# EasyEDA schematic SCH_USB Timer_2022-08-03.json
TITLE: Sheet_1; REV: 0.2; Date: 2022-07-23; Sheet: 1/1; Drawn By: Spencer Owen; Company: Your Company
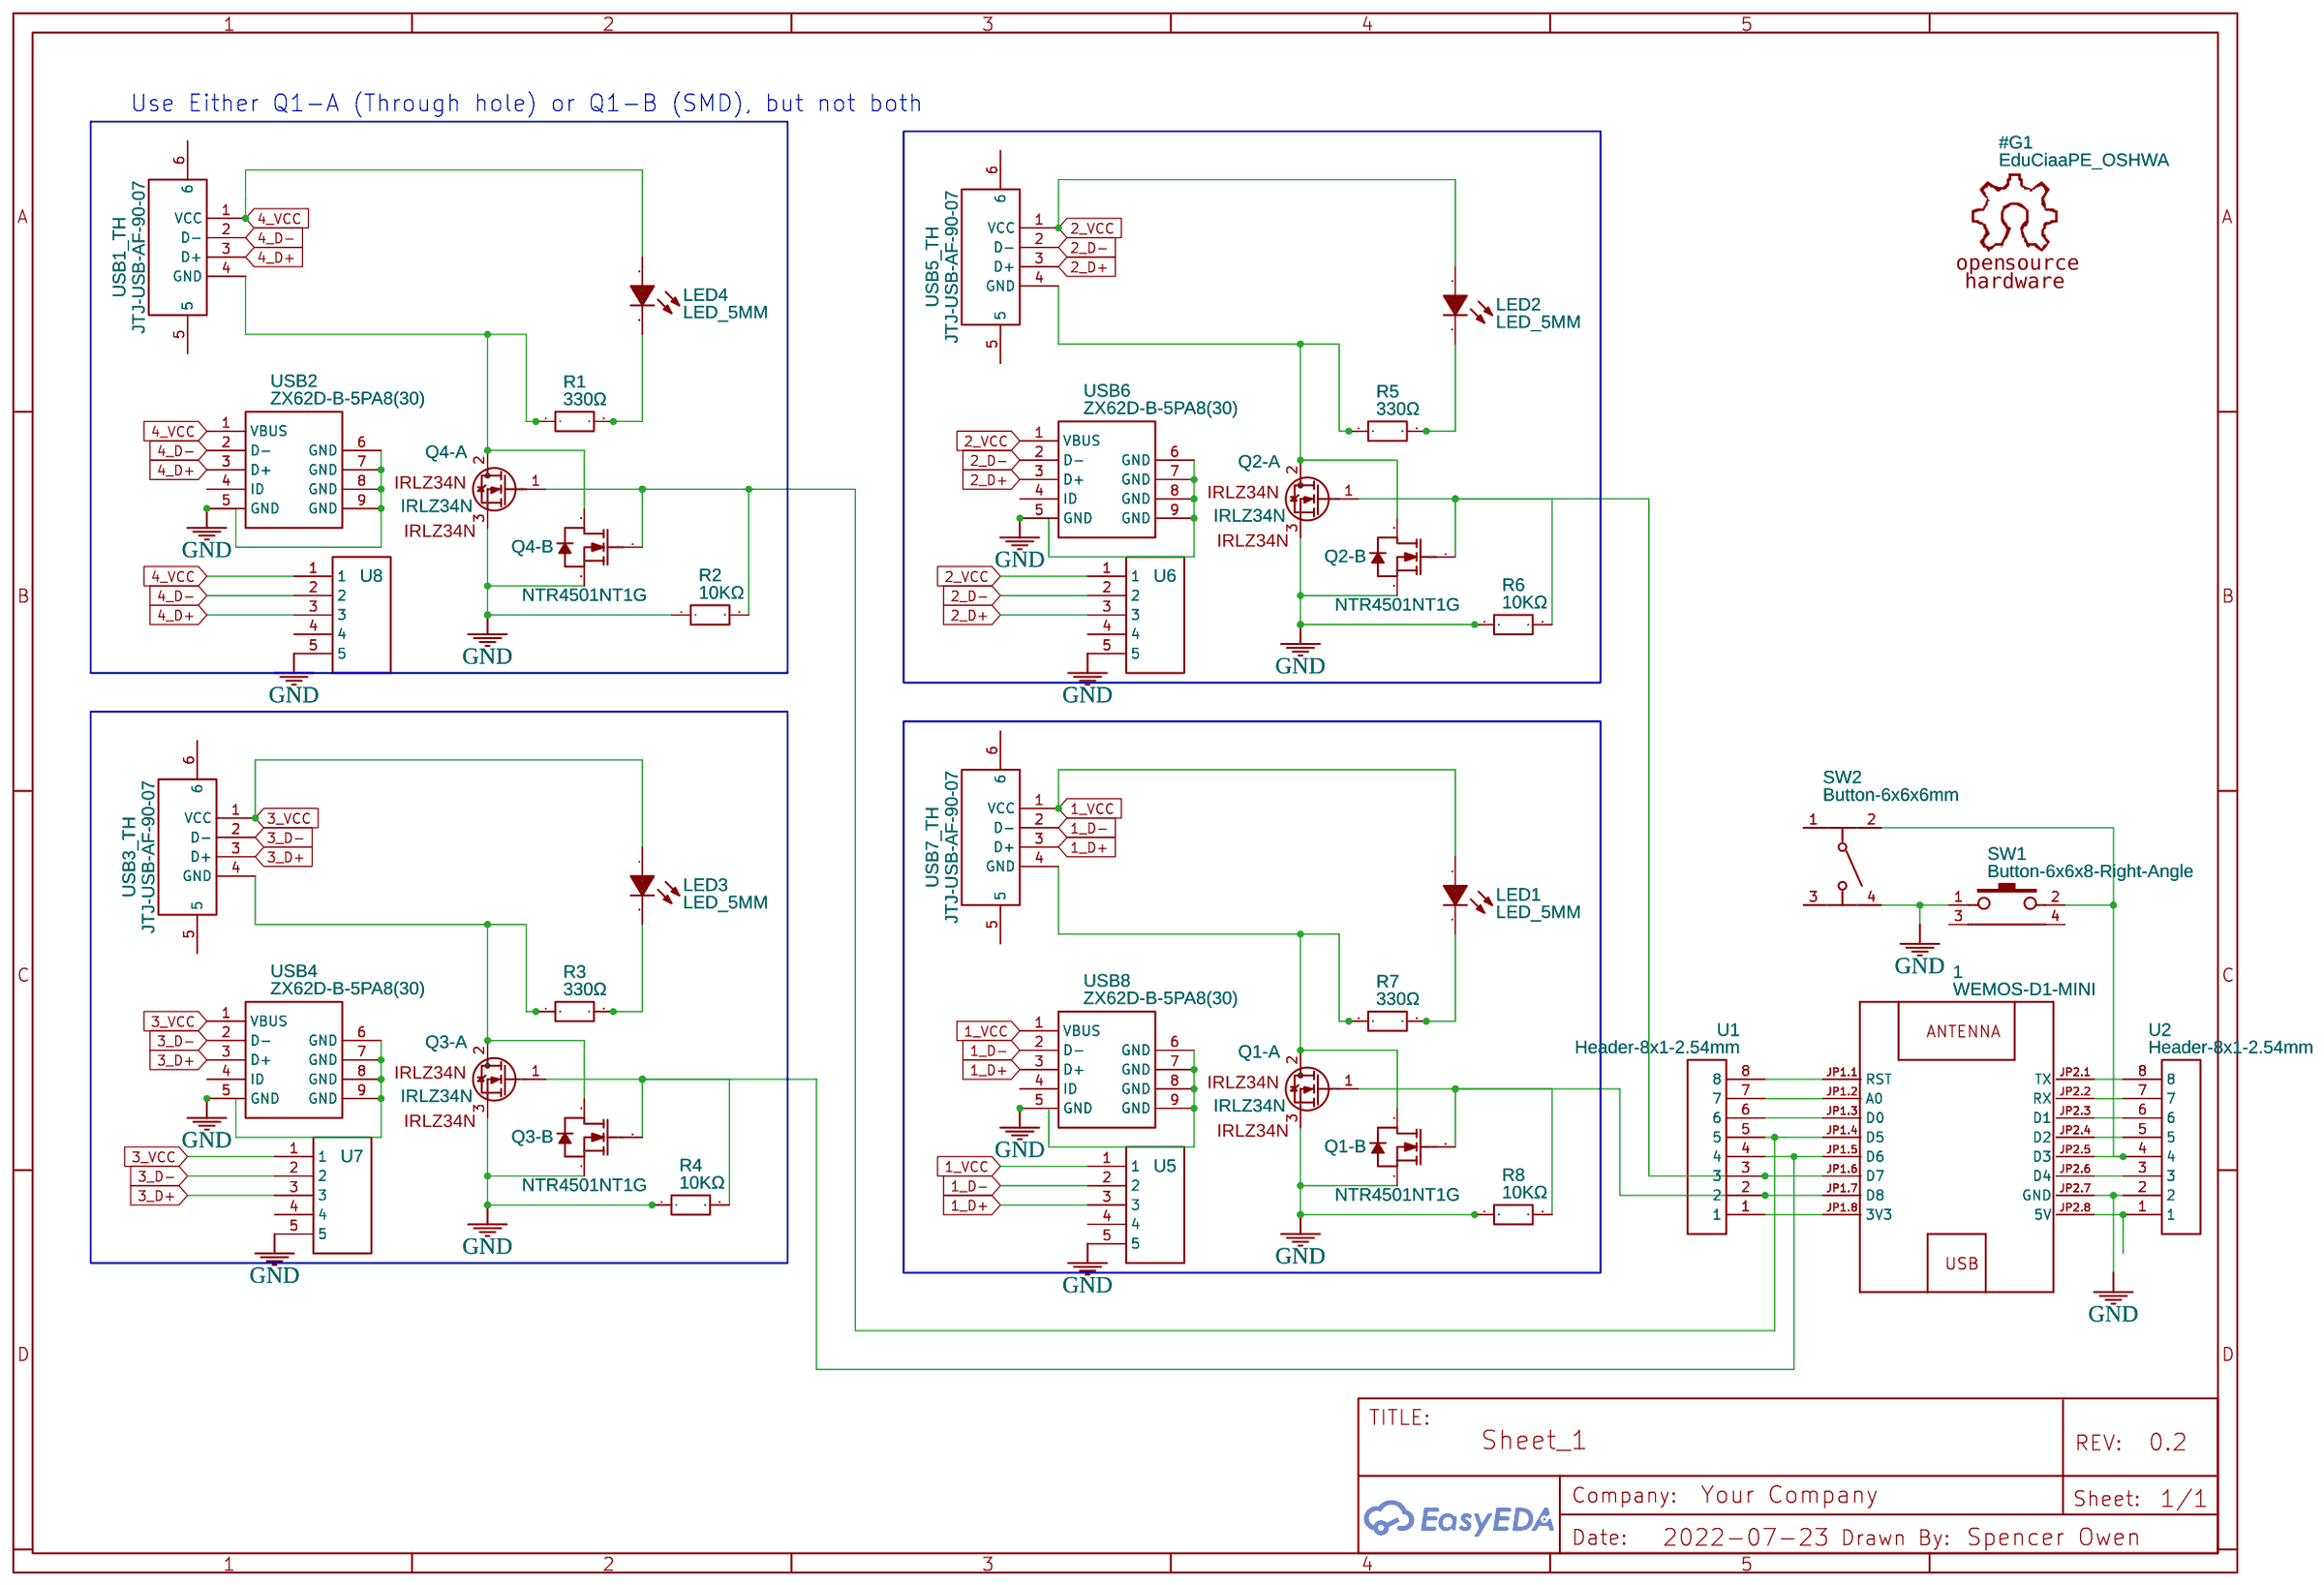
[diagram p0: schematic sheet]

## Parts
1  WEMOS-D1-MINI  [WEMOS-D1-MINI]
#G1  EduCiaaPE_OSHWA  [LOGO_OSHWA]
LED1  LED_5MM  [LED-TH_BD5.0-P2.54-FD_C9900023552]
LED2  LED_5MM  [LED-TH_BD5.0-P2.54-FD_C9900023552]
LED3  LED_5MM  [LED-TH_BD5.0-P2.54-FD_C9900023552]
LED4  LED_5MM  [LED-TH_BD5.0-P2.54-FD_C9900023552]
Q1-A  IRLZ34N  [IRLZ34N]
Q1-B  NTR4501NT1G  [SOT-23-3_L2.9-W1.3-P1.90-LS2.4-BR]
Q2-A  IRLZ34N  [IRLZ34N]
Q2-B  NTR4501NT1G  [SOT-23-3_L2.9-W1.3-P1.90-LS2.4-BR]
Q3-A  IRLZ34N  [IRLZ34N]
Q3-B  NTR4501NT1G  [SOT-23-3_L2.9-W1.3-P1.90-LS2.4-BR]
Q4-A  IRLZ34N  [IRLZ34N]
Q4-B  NTR4501NT1G  [SOT-23-3_L2.9-W1.3-P1.90-LS2.4-BR]
R1  330Ω  [RES-TH_BD2.4-L6.3-P10.30-D0.6]
R2  10KΩ  [RES-TH_BD2.4-L6.3-P10.30-D0.6]
R3  330Ω  [RES-TH_BD2.4-L6.3-P10.30-D0.6]
R4  10KΩ  [RES-TH_BD2.4-L6.3-P10.30-D0.6]
R5  330Ω  [RES-TH_BD2.4-L6.3-P10.30-D0.6]
R6  10KΩ  [RES-TH_BD2.4-L6.3-P10.30-D0.6]
R7  330Ω  [RES-TH_BD2.4-L6.3-P10.30-D0.6]
R8  10KΩ  [RES-TH_BD2.4-L6.3-P10.30-D0.6]
SW1  Button-6x6x8-Right-Angle  [SW-TH_BBJ-C71833]
SW2  Button-6x6x6mm  [SW-TH_4P-L6.0-W6.0-P4.50-LS6.1]
U1  Header-8x1-2.54mm  [HEADER-8X1-2.54MM]
U2  Header-8x1-2.54mm  [HEADER-8X1-2.54MM]
U5  Header-5x1-2.54mm  [HEADER-5X1-2.54MM]
U6  Header-5x1-2.54mm  [HEADER-5X1-2.54MM]
U7  Header-5x1-2.54mm  [HEADER-5X1-2.54MM]
U8  Header-5x1-2.54mm  [HEADER-5X1-2.54MM]
USB1_TH  JTJ-USB-AF-90-07  [USB-A-TH_C42650]
USB2  ZX62D-B-5PA8(30)  [MICRO-USB-SMD_ZX62D-B-5PA8-30]
USB3_TH  JTJ-USB-AF-90-07  [USB-A-TH_C42650]
USB4  ZX62D-B-5PA8(30)  [MICRO-USB-SMD_ZX62D-B-5PA8-30]
USB5_TH  JTJ-USB-AF-90-07  [USB-A-TH_C42650]
USB6  ZX62D-B-5PA8(30)  [MICRO-USB-SMD_ZX62D-B-5PA8-30]
USB7_TH  JTJ-USB-AF-90-07  [USB-A-TH_C42650]
USB8  ZX62D-B-5PA8(30)  [MICRO-USB-SMD_ZX62D-B-5PA8-30]

## Library data of the parts
1 = WEMOS-D1-MINI: Contributor: 4ndy
#G1 = EduCiaaPE_OSHWA: Contributor: Juan Pablo Menditto
LED1-LED4 = LED_5MM: Supplier: LCSC; Supplier Part: C9900023552; Manufacturer: null; JLCPCB Part Class: Extended Part; Contributor: lcsc
Q1-A Q2-A Q3-A Q4-A = IRLZ34N: Contributor: WDMason
Q1-B Q2-B Q3-B Q4-B = NTR4501NT1G: Supplier: LCSC; Manufacturer: ON; Supplier Part: C85416; JLCPCB Part Class: Extended Part
R1-R8 = MFR-25FBF52-93K1: Supplier: LCSC; Supplier Part: C1369201; Manufacturer: YAGEO(国巨); link: https://atta.szlcsc.com/upload/public/pdf/source/20210730/C1369201_7B4B073A00DCD3392AECD92F10A4BDE9.pdf; Resistance: 93.1kΩ; Contributor: lcsc
SW1 = Button-6x6x8-Right-Angle: Supplier Part: C71833; Supplier: LCSC; Manufacturer: BBJ; Manufacturer Part: 6*6*8Plastic head,260G, 0.25mm,Side bracket
SW2 = Button-6x6x6mm: Supplier Part: C71836; Supplier: LCSC; Manufacturer: BBJ; Manufacturer Part: Switch,6*6*6Plastic head,260G, 0.25mm,Straight line
U1 U2 = Header-8x1-2.54mm: Contributor: abdussamet28051999
U5-U8 = Header-5x1-2.54mm: Contributor: abdussamet28051999
USB1_TH USB3_TH USB5_TH USB7_TH = JTJ-USB-AF-90-07: Supplier: LCSC; Supplier Part: C42650; Manufacturer: LCSC; Contributor: LCSC; JLCPCB Part Class: Extended Part
USB2 USB4 USB6 USB8 = ZX62D-B-5PA8(30): Supplier: LCSC; Supplier Part: C132350; Manufacturer: HRS(Hirose); Contributor: LCSC; JLCPCB Part Class: Extended Part

## Nets
GND: 1.JP2.7(GND) Q1-A.3(S) Q1-B.2(S) Q2-A.3(S) Q2-B.2(S) Q3-A.3(S) Q3-B.2(S) Q4-A.3(S) Q4-B.2(S) R2.1 R4.1 R6.1 R8.1 SW1.1 SW2.4 U2.2 U5.5 U6.5 U7.5 U8.5 USB2.5(GND) USB2.6(GND) USB2.7(GND) USB2.8(GND) USB2.9(GND) USB4.5(GND) USB4.6(GND) USB4.7(GND) USB4.8(GND) USB4.9(GND) USB6.5(GND) USB6.6(GND) USB6.7(GND) USB6.8(GND) USB6.9(GND) USB8.5(GND) USB8.6(GND) USB8.7(GND) USB8.8(GND) USB8.9(GND)
1_D+: U5.3 USB7_TH.3(D+) USB8.3(D+)
1_D-: U5.2 USB7_TH.2(D-) USB8.2(D-)
1_VCC: LED1.1(A) U5.1 USB7_TH.1(VCC) USB8.1(VBUS)
2_D+: U6.3 USB5_TH.3(D+) USB6.3(D+)
2_D-: U6.2 USB5_TH.2(D-) USB6.2(D-)
2_VCC: LED2.1(A) U6.1 USB5_TH.1(VCC) USB6.1(VBUS)
3_D+: U7.3 USB3_TH.3(D+) USB4.3(D+)
3_D-: U7.2 USB3_TH.2(D-) USB4.2(D-)
3_VCC: LED3.1(A) U7.1 USB3_TH.1(VCC) USB4.1(VBUS)
4_D+: U8.3 USB1_TH.3(D+) USB2.3(D+)
4_D-: U8.2 USB1_TH.2(D-) USB2.2(D-)
4_VCC: LED4.1(A) U8.1 USB1_TH.1(VCC) USB2.1(VBUS)
Net-(1-JP1.1): 1.JP1.1(RST) U1.8
Net-(1-JP1.2): 1.JP1.2(A0) U1.7
Net-(1-JP1.3): 1.JP1.3(D0) U1.6
Net-(1-JP1.4): 1.JP1.4(D5) Q4-A.1(G) Q4-B.1(G) R2.2 U1.5
Net-(1-JP1.5): 1.JP1.5(D6) Q3-A.1(G) Q3-B.1(G) R4.2 U1.4
Net-(1-JP1.6): 1.JP1.6(D7) Q2-A.1(G) Q2-B.1(G) R6.2 U1.3
Net-(1-JP1.7): 1.JP1.7(D8) Q1-A.1(G) Q1-B.1(G) R8.2 U1.2
Net-(1-JP1.8): 1.JP1.8(3V3) U1.1
Net-(1-JP2.1): 1.JP2.1(TX) U2.8
Net-(1-JP2.2): 1.JP2.2(RX) U2.7
Net-(1-JP2.3): 1.JP2.3(D1) U2.6
Net-(1-JP2.4): 1.JP2.4(D2) U2.5
Net-(1-JP2.5): 1.JP2.5(D3) SW1.2 SW2.2 U2.4
Net-(1-JP2.6): 1.JP2.6(D4) U2.3
Net-(1-JP2.8): 1.JP2.8(5V) U2.1
Net-(LED1-2): LED1.2(K) R7.2
Net-(LED2-2): LED2.2(K) R5.2
Net-(LED3-2): LED3.2(K) R3.2
Net-(LED4-2): LED4.2(K) R1.2
Net-(Q1-A-2): Q1-A.2(D) Q1-B.3(D) R7.1 USB7_TH.4(GND)
Net-(Q2-A-2): Q2-A.2(D) Q2-B.3(D) R5.1 USB5_TH.4(GND)
Net-(Q3-A-2): Q3-A.2(D) Q3-B.3(D) R3.1 USB3_TH.4(GND)
Net-(Q4-A-2): Q4-A.2(D) Q4-B.3(D) R1.1 USB1_TH.4(GND)

Not connected (* = marked no-connect by the designer): SW1 3 4; SW2 1 3; U5 4; U6 4; U7 4; U8 4; USB1_TH 5 6; USB2 4(ID); USB3_TH 5 6; USB4 4(ID); USB5_TH 5 6; USB6 4(ID); USB7_TH 5 6; USB8 4(ID)

## Notes on the sheet
- Use Either Q1-A (Through hole) or Q1-B (SMD), but not both
